# EAGLE design PowerBoard (EAGLE 7.3.0)
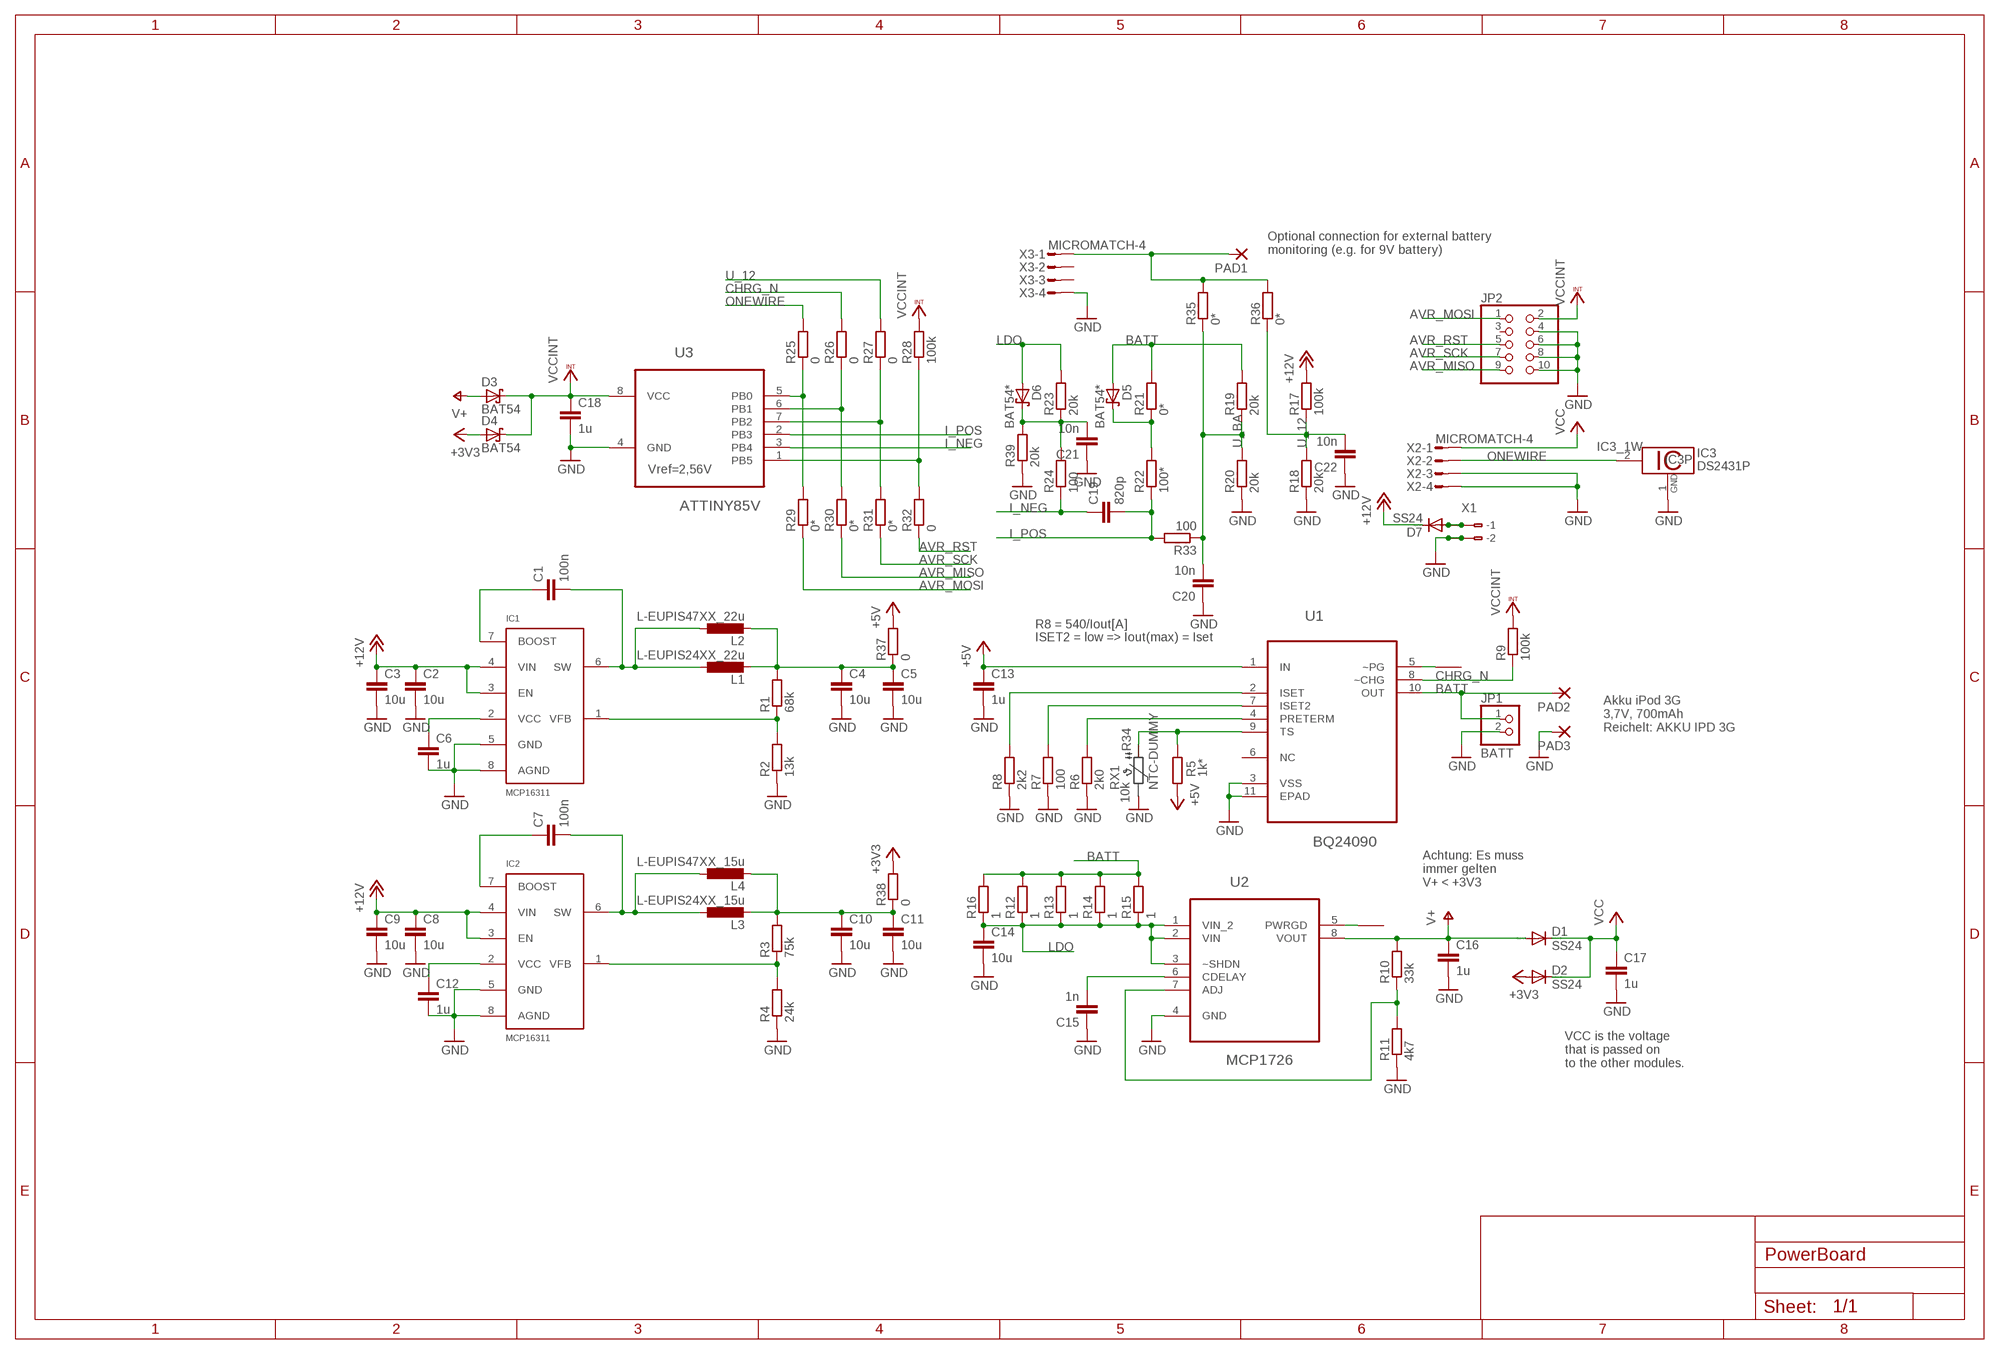
[diagram p0: schematic, sheet 1]

## Parts
C1  100n  C-EUC0603  [C0603]
C2  10u  C-EUC1210  [C1210]
C3  10u  C-EUC1210  [C1210]
C4  10u  C-EUC1210  [C1210]
C5  10u  C-EUC1210  [C1210]
C6  1u  C-EUC0603  [C0603]
C7  100n  C-EUC0603  [C0603]
C8  10u  C-EUC1210  [C1210]
C9  10u  C-EUC1210  [C1210]
C10  10u  C-EUC1210  [C1210]
C11  10u  C-EUC1210  [C1210]
C12  1u  C-EUC0603  [C0603]
C13  1u  C-EUC0603  [C0603]
C14  10u  C-EUC1210  [C1210]
C15  1n  C-EUC0603  [C0603]
C16  1u  C-EUC0603  [C0603]
C17  1u  C-EUC0603  [C0603]
C18  1u  C-EUC0603  [C0603]
C19  820p  C-EUC0603  [C0603]
C20  10n  C-EUC0603  [C0603]
C21  10n  C-EUC0603  [C0603]
C22  10n  C-EUC0603  [C0603]
D1  SS24  DIODE-SMB  [SMB]
D2  SS24  DIODE-SMB  [SMB]
D3  BAT54  [SOT23]
D4  BAT54  [SOT23]
D5  BAT54*  BAT54  [SOT23]
D6  BAT54*  BAT54  [SOT23]
D7  SS24  DIODE-SMB  [SMB]
IC1  MCP16311  [SOP65P490X110-8N]
IC2  MCP16311  [SOP65P490X110-8N]
IC3  DS2431P  [TSOC6]
JP1  BATT  PINHD-1X2  [1X02]
JP2  PINHD-2X5  [2X05]
L1  L-EUPIS24XX_22u  L-EUPIS24XX  [PIS24XX]
L2  L-EUPIS47XX_22u  L-EUPIS47XX  [PIS47XX]
L3  L-EUPIS24XX_15u  L-EUPIS24XX  [PIS24XX]
L4  L-EUPIS47XX_15u  L-EUPIS47XX  [PIS47XX]
PAD1  WIREPADSMD2,54-5,08  [SMD2,54-5,08]
PAD2  WIREPADSMD2,54-5,08  [SMD2,54-5,08]
PAD3  WIREPADSMD2,54-5,08  [SMD2,54-5,08]
R1  68k  R-EU_R0603  [R0603]
R2  13k  R-EU_R0603  [R0603]
R3  75k  R-EU_R0603  [R0603]
R4  24k  R-EU_R0603  [R0603]
R5  1k*  R-EU_R0603  [R0603]
R6  2k0  R-EU_R0603  [R0603]
R7  100  R-EU_R0603  [R0603]
R8  2k2  R-EU_R0603  [R0603]
R9  100k  R-EU_R0603  [R0603]
R10  33k  R-EU_R0603  [R0603]
R11  4k7  R-EU_R0603  [R0603]
R12  1  R-EU_R0402  [R0402]
R13  1  R-EU_R0402  [R0402]
R14  1  R-EU_R0402  [R0402]
R15  1  R-EU_R0402  [R0402]
R16  1  R-EU_R0402  [R0402]
R17  100k  R-EU_R0603  [R0603]
R18  20k  R-EU_R0603  [R0603]
R19  20k  R-EU_R0603  [R0603]
R20  20k  R-EU_R0603  [R0603]
R21  0*  R-EU_R0603  [R0603]
R22  100*  R-EU_R0603  [R0603]
R23  20k  R-EU_R0603  [R0603]
R24  100  R-EU_R0603  [R0603]
R25  0  R-EU_R0402  [R0402]
R26  0  R-EU_R0402  [R0402]
R27  0  R-EU_R0402  [R0402]
R28  100k  R-EU_R0402  [R0402]
R29  0*  R-EU_R0402  [R0402]
R30  0*  R-EU_R0402  [R0402]
R31  0*  R-EU_R0402  [R0402]
R32  0  R-EU_R0402  [R0402]
R33  100  R-EU_R0603  [R0603]
R34  10k  R-EU_R0603  [R0603]
R35  0*  R-EU_R0603  [R0603]
R36  0*  R-EU_R0603  [R0603]
R37  0  R-EU_R0603  [R0603]
R38  0  R-EU_R0603  [R0603]
R39  20k  R-EU_R0603  [R0603]
U1  BQ24090  BQ24090DGQT  [SOP50P490X110-11N]
U2  MCP1726  MCP1726-3302E/SN  [SOIC127P490X175-8N]
U3  ATTINY85V  ATTINY85V-10SU  [SOIC127P798X216-8N]
U$1  PAD100-RND  [PAD-100-RND]
U$3  PAD100-RND  [PAD-100-RND]
X1  233-102  [233-102]
X2  MICROMATCH-4  [MICROMATCH-4]
X3  MICROMATCH-4  [MICROMATCH-4]

## Nets
+3V3: D2.A D4.1(A) R38.2
+5V: C13.1 R5.1 R37.2 U1.1(IN)
+12V: C2.1 C3.1 C8.1 C9.1 D7.C IC1.3(EN) IC1.4(VIN) IC2.3(EN) IC2.4(VIN) R17.2
AVR_MISO: JP2.9 R30.1
AVR_MOSI: JP2.1 R29.1
AVR_RST: JP2.5 R32.1
AVR_SCK: JP2.7 R31.1
BATT: D5.1(A) JP1.1 PAD2.1(P) R12.2 R13.2 R14.2 R15.2 R16.2 R19.2 R21.2 U1.10(OUT)
CHRG_N: R9.1 R26.2 U1.8(~CHG)
GND: C2.2 C3.2 C4.2 C5.2 C6.2 C8.2 C9.2 C10.2 C11.2 C12.2 C13.2 C14.2 C15.1 C16.2 C17.2 C18.2 C20.1 C21.1 C22.1 IC1.5(GND) IC1.8(AGND) IC2.5(GND) IC2.8(AGND) IC3.1(GND) JP1.2 JP2.4 JP2.6 JP2.8 JP2.10 PAD3.1(P) R2.1 R4.1 R6.1 R7.1 R8.1 R11.1 R18.1 R20.1 R34.1 R39.1 U1.3(VSS) U1.11(EPAD) U2.4(GND) U3.4(GND) X1.A2(-2) X1.B2(B-2) X2.3 X2.4 X3.4
I_NEG: C19.1 R24.1 U3.3(PB4)
I_POS: C19.2 R22.1 R33.2 U3.2(PB3)
LDO: C14.1 D6.1(A) R12.1 R13.1 R14.1 R15.1 R16.1 R23.2 U2.1(VIN_2) U2.2(VIN) U2.3(~SHDN)
N$1: C1.1 IC1.7(BOOST)
N$2: C1.2 IC1.6(SW) L1.2 L2.2
N$3: U2.5(PWRGD) U$3.P$1
N$4: R8.2 U1.2(ISET)
N$5: IC1.1(VFB) R1.1 R2.2
N$6: R7.2 U1.7(ISET2)
N$7: C6.1 IC1.2(VCC)
N$8: R6.2 U1.4(PRETERM)
N$9: C7.1 IC2.7(BOOST)
N$10: C7.2 IC2.6(SW) L3.2 L4.2
N$11: IC2.1(VFB) R3.1 R4.2
N$12: C12.1 IC2.2(VCC)
N$13: R5.2 R34.2 U1.9(TS)
N$14: U1.5(~PG) U$1.P$1
N$15: C15.2 U2.6(CDELAY)
N$16: R28.1 R32.2 U3.1(PB5)
N$17: D5.3(C) R21.1 R22.2
N$18: R27.1 R31.2 U3.7(PB2)
N$19: R26.1 R30.2 U3.6(PB1)
N$20: R10.1 R11.2 U2.7(ADJ)
N$21: C21.2 D6.3(C) R23.1 R24.2 R39.2
N$22: D7.A X1.A1(-1) X1.B1(B-1)
N$23: R25.1 R29.2 U3.5(PB0)
N$24: PAD1.1(P) R35.2 R36.2 X3.1
N$25: C4.1 C5.1 L1.1 L2.1 R1.2 R37.1
N$26: C10.1 C11.1 L3.1 L4.1 R3.2 R38.1
ONEWIRE: IC3.2(1W) R25.2 X2.2
U_12: C22.2 R17.1 R18.2 R27.2 R36.1
U_BA: C20.2 R19.1 R20.2 R33.1 R35.1
V+: C16.1 D1.A D3.1(A) R10.2 U2.8(VOUT)
VCC: C17.1 D1.C D2.C X2.1
VCCINT: C18.1 D3.3(C) D4.3(C) JP2.2 R9.2 R28.2 U3.8(VCC)
Unconnected: JP2.3 U1.6(NC) X3.2 X3.3

## Notes on the sheet
- Optional connection for external battery
  monitoring (e.g. for 9V battery)
- Vref=2,56V
- R8 = 540/Iout[A]
- ISET2 = low => Iout(max) = Iset
- Akku iPod 3G
  3,7V, 700mAh
  Reichelt: AKKU IPD 3G
- Achtung: Es muss
  immer gelten
  V+ < +3V3
- VCC is the voltage
  that is passed on
  to the other modules.

## Library data of the parts
C1-C22 = rcl:C-EU: CAPACITOR, European symbol
D1 D2 D7 = diode:DIODE-: DIODE
D3-D6 = diode:BAT54: Schottky Diodes Source: Fairchild .. BAT54.pdf
IC1 IC2 = mcp16311_SOP65P490X110-8N:MCP16311
IC3 = 1wire:DS2431: 1024-Bit EEPROM This chip provides a 4x256 Bit EEPROM, which can be programmed@5V. Write protection and OTP emulation are available, too. Author: Jan Kandziora <jjj@gmx.de>
JP1 = pinhead:PINHD-1X2: PIN HEADER
JP2 = pinhead:PINHD-2X5: PIN HEADER
L1-L4 = Inductor-Fastron:L-EU
PAD1-PAD3 = wirepad:WIREPAD: Wire PAD connect wire on PCB
R1-R39 = rcl:R-EU_: RESISTOR, European symbol
U1 = BQ24090DGQT:BQ24090DGQT: 1A, Single-Input, Single Cell Li-Ion Battery Charger; AVAILABILITY: Good; DESCRIPTION: 1A%2C Single Input%2C Single Cell Li-Ion Battery Charger w/ 10k%3F NTC %7C Li-ion Linear Battery Charger IC 10-MSOP-PowerPAD ...; MF: Texas Instruments; MP: BQ24090DGQT; PACKAGE: MSOP-10 Texas Instruments; PRICE: 0.96 USD
U2 = MCP1726-3302E_SN:MCP1726-3302E/SN: Current LDO Regulator; AVAILABILITY: Good; DESCRIPTION: MCP1726 Series 1 A 3.3 V Fixed Output Surface Mount LDO Regulator - SOIC-8; MF: Microchip; MP: MCP1726-3302E/SN; PACKAGE: SOIC-8 Microchip; PRICE: 0.63 USD
U3 = ATTINY85V-10SU:ATTINY85V-10SU: 8-bit Microcontroller with In-System Programmable Flash; AVAILABILITY: Good; DESCRIPTION: ATtiny Series 10 MHz 8 KB Flash 512 B SRAM 8-Bit Microcontroller - SOIC-8; MF: Atmel; MP: ATTINY85V-10SU; PACKAGE: SOIC-8 Atmel; PRICE: 1.19 USD
U$1 U$3 = Pinoccio:PAD
X1 = con-wago:233-102: WAGO Cage Clamp; MPN: 233-102; OC_FARNELL: unknown; OC_NEWARK: 28K9044
X2 X3 = con-amp-micromatch:MICROMATCH-4: MicroMaTch 4 7-215464-4 / 0-215464-4 Drawing Number C-215464 DDEController.pdf; MPN: 7-215464-4; OC_FARNELL: 3784629; OC_NEWARK: 19R8124

## Board
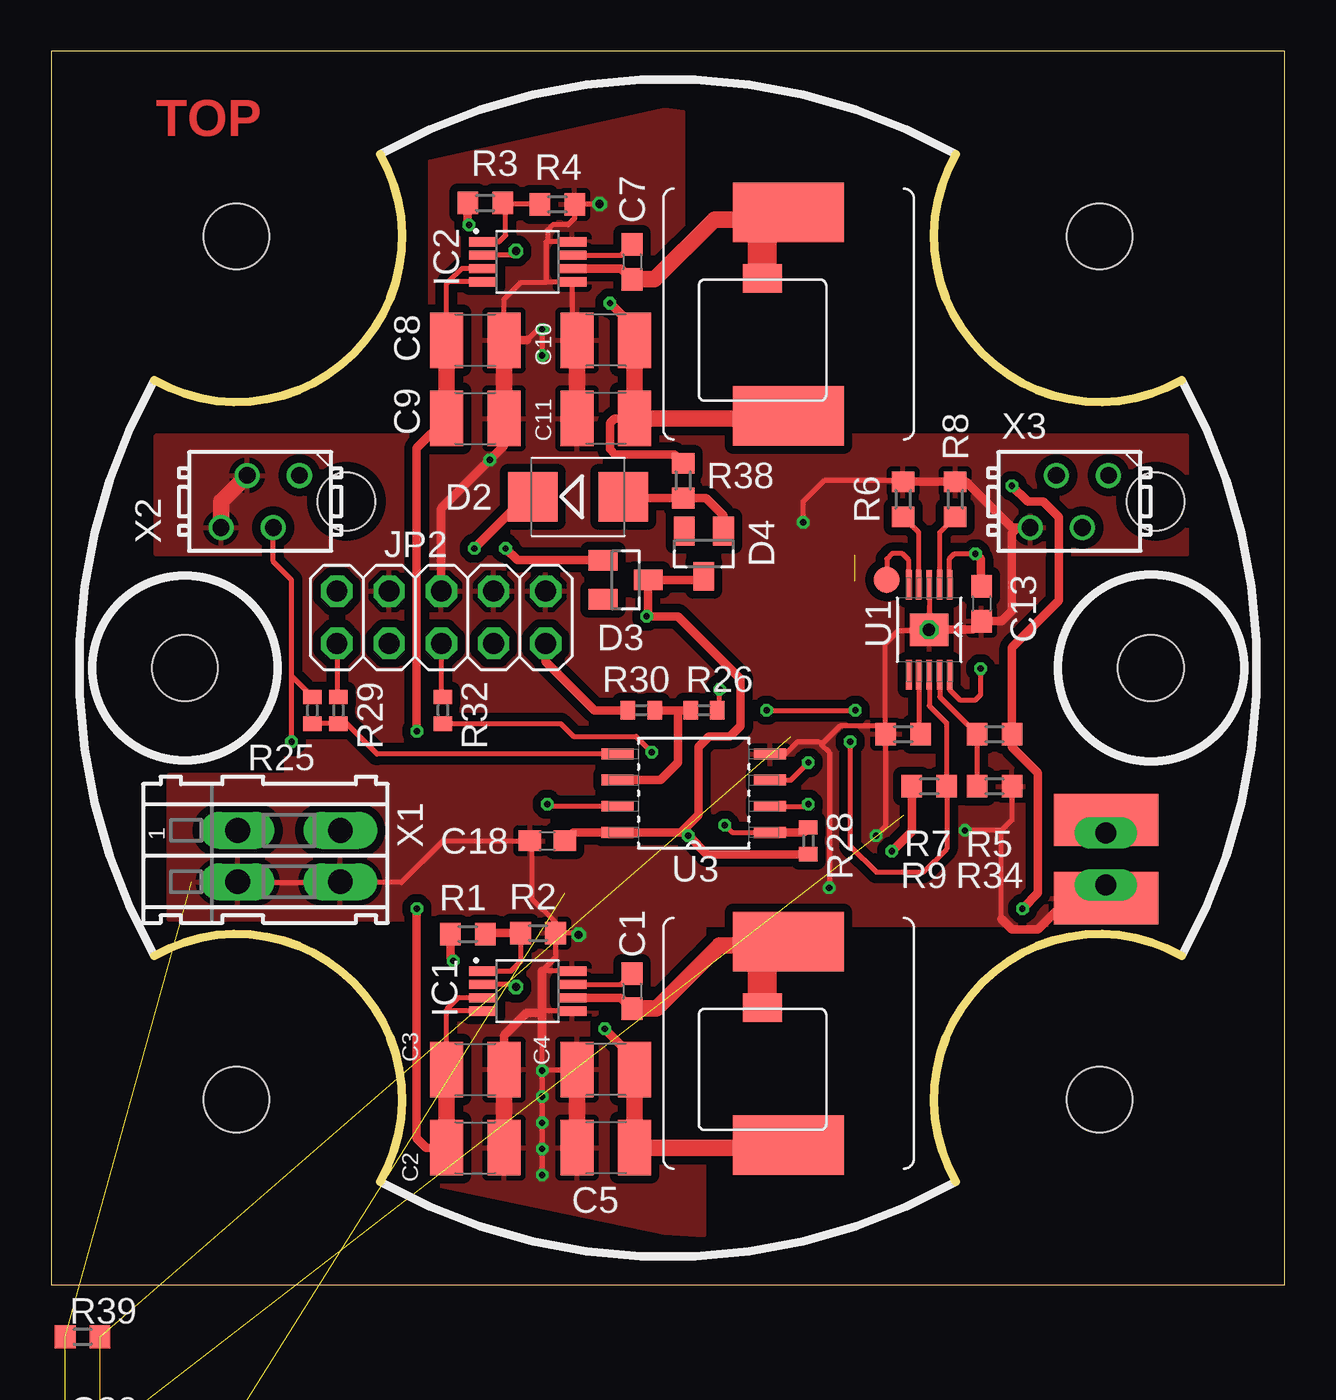
[diagram p1: board, top side]
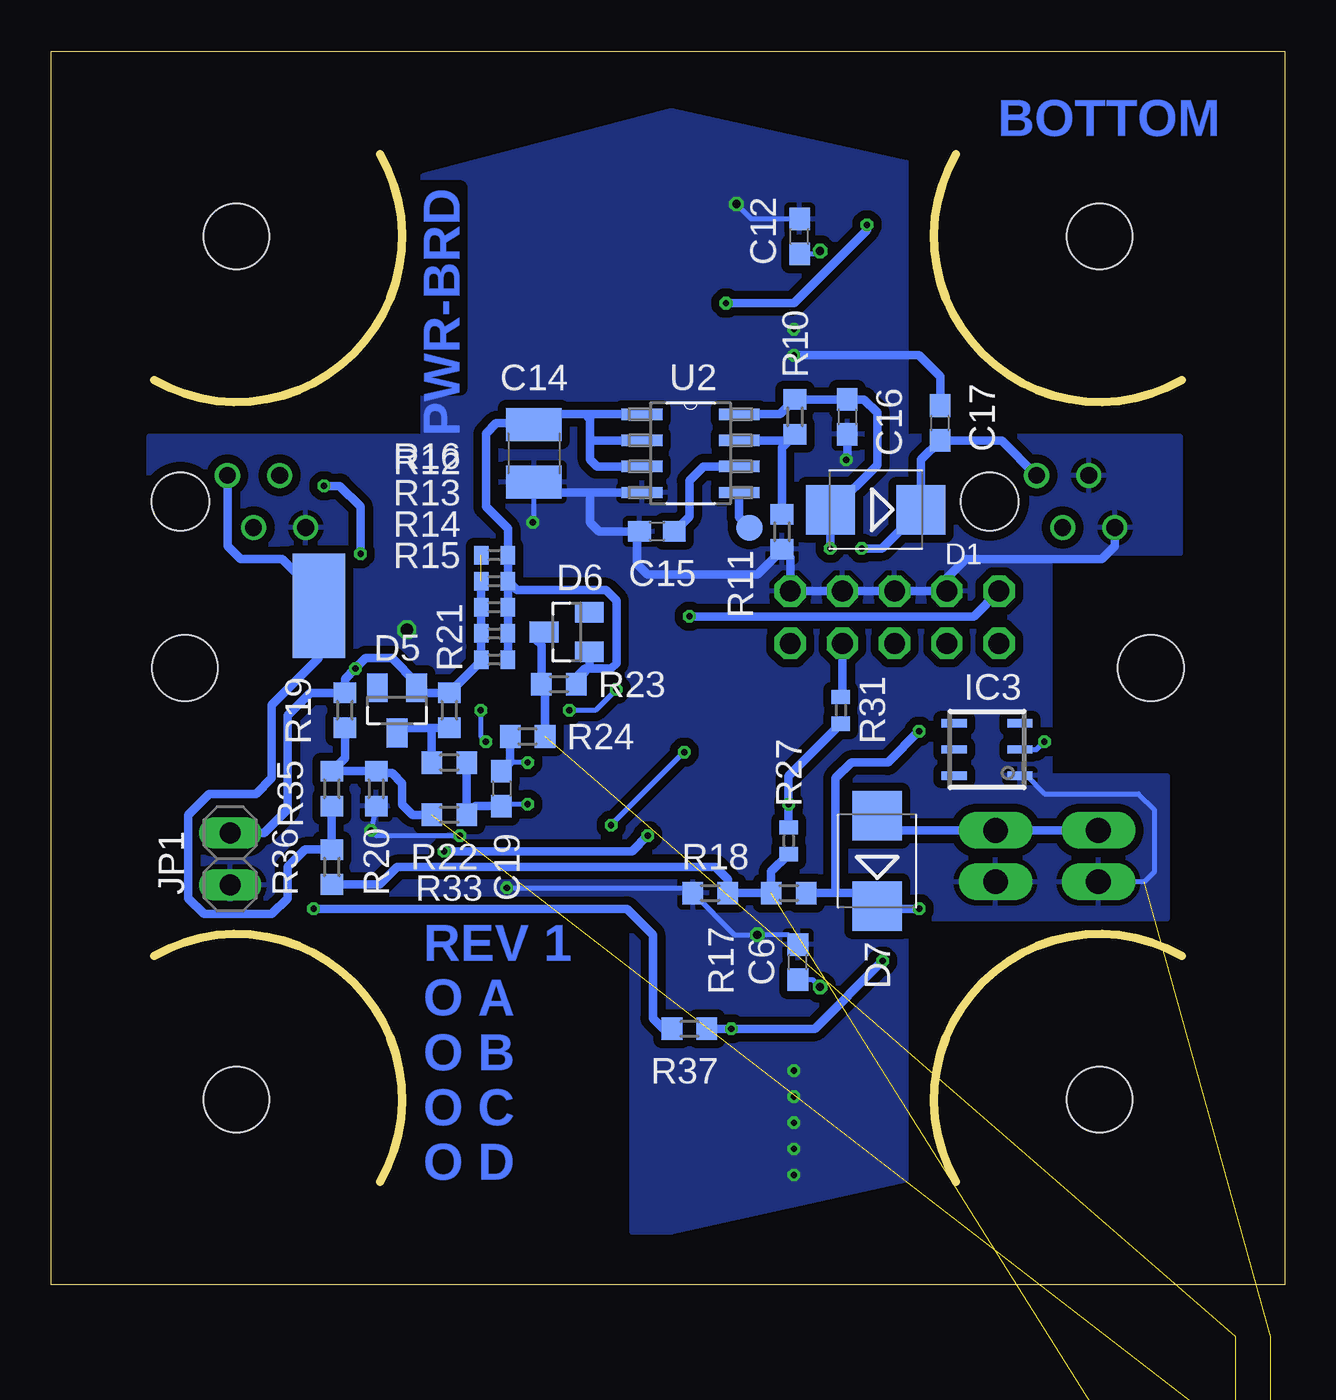
[diagram p2: board, bottom side, seen from below]

Size 60 x 60 mm. Coordinates in mm from the lower left corner, seen from the top.
Outline: 0,0 60,0 60,60 0,60 0,0
Copper layers (1*16): Top 0.035mm / dielectric 1.6mm / Bottom 0.035mm
Design rules "Elecrow_2-layer_PCB_eagle_rule": minimum track width 6mil, minimum drill 12mil, track to track 6mil, track to pad 6mil, pad to pad 6mil, via to via 8mil, smd to smd 0mil, copper to edge 20mil, drill to drill 10mil, minimum pad ring 6mil, minimum via ring 6mil, stop-mask expansion 0mil, vias tented up to drill 100mil, thermal gap 10mil
Holes 3.2 mm at 9,51 51,51 51,9 9,9 6.5,30 53.5,30
Holes 2.8 mm at 14.35,38.1 53.72,38.1
Milling: 4 lines

### Footprints (pad centres in the part's own frame; a part is rotated, then mirrored left to right if it is on the bottom)
C0603 = smd 1.1 x 1: 1 -0.85,0; 2 0.85,0
C1210 = smd 1.6 x 2.7: 1 -1.4,0; 2 1.4,0
SMB = smd 2.4 x 2.4: A 2.2,0; C -2.2,0
SOT23 = smd 1 x 1.4: 1 -0.95,-1.1; 2 0.95,-1.1; 3 0,1.1
SOP65P490X110-8N = smd 1.38 x 0.45: 1 -2.165,0.975; 2 -2.165,0.325; 3 -2.165,-0.325; 4 -2.165,-0.975; 5 2.165,-0.975; 6 2.165,-0.325; 7 2.165,0.325; 8 2.165,0.975
TSOC6 = smd 0.406 x 1.219: 1 -1.27,-1.6; 2 0,-1.6; 3 1.27,-1.6; 4 1.27,1.6; 5 0,1.6; 6 -1.27,1.6
1X02 = drill 1.016 long: 1 -1.27,0; 2 1.27,0
2X05 = drill 1.016 octagon: 1 -5.08,-1.27; 2 -5.08,1.27; 3 -2.54,-1.27; 4 -2.54,1.27; 5 0,-1.27; 6 0,1.27; 7 2.54,-1.27; 8 2.54,1.27; 9 5.08,-1.27; 10 5.08,1.27
PIS24XX = smd 1.4 x 1.9: 1 -3,0; 2 3,0
PIS47XX = smd 2.9 x 5.4: 1 -4.95,0; 2 4.95,0
SMD2,54-5,08 = smd 2.54 x 5.08: 1 0,0
R0603 = smd 1 x 1.1: 1 -0.85,0; 2 0.85,0
R0402 = smd 0.7 x 0.9: 1 -0.65,0; 2 0.65,0
SOP50P490X110-11N = smd 1.422 x 0.279: 1 -2.184,0.991; 2 -2.184,0.508; 3 -2.184,0; 4 -2.184,-0.508; 5 -2.184,-0.991; 6 2.184,-0.991; 7 2.184,-0.508; 8 2.184,0; 9 2.184,0.508; 10 2.184,0.991 | smd 1.575 x 1.88: 11 0,0
SOIC127P490X175-8N = smd 1.981 x 0.559: 1 -2.362,1.905; 2 -2.362,0.635; 3 -2.362,-0.635; 4 -2.362,-1.905; 5 2.362,-1.905; 6 2.362,-0.635; 7 2.362,0.635; 8 2.362,1.905
SOIC127P798X216-8N = smd 1.549 x 0.533: 1 -3.708,1.905; 2 -3.708,0.635; 3 -3.708,-0.635; 4 -3.708,-1.905; 5 3.708,-1.905; 6 3.708,-0.635; 7 3.708,0.635; 8 3.708,1.905
PAD-100-RND = smd 1.27 x 1.27: P$1 0,0
233-102 = drill 1.2 long: A1 -1.25,2.5; A2 1.25,2.5; B1 -1.25,-2.5; B2 1.25,-2.5
MICROMATCH-4 = drill 0.813: 1 1.905,1.27; 2 0.635,-1.27; 3 -0.635,1.27; 4 -1.905,-1.27

### Placement (x,y rotation side)
C1  28.25,14.28 270 top
C2  20.63,6.66 0 top
C3  20.63,10.47 0 top
C4  26.98,10.47 180 top
C5  26.98,6.66 180 top
C6  23.68,15.69 90 bottom
C7  28.25,49.76 270 top
C8  20.63,45.95 0 top
C9  20.63,42.14 0 top
C10  26.98,45.95 180 top
C11  26.98,42.14 180 top
C12  23.6,51 90 bottom
C13  45.25,33.13 270 top
C14  36.52,40.44 270 bottom
C15  30.54,36.65 0 bottom
C16  21.28,42.22 270 bottom
C17  16.76,41.92 90 bottom
C18  24.13,21.59 180 top
C19  38.1,24.13 270 bottom
C20  1.52,-7.37 0 top  (outside the outline)
C21  1.52,-12.19 0 top  (outside the outline)
C22  1.52,-17.02 0 top  (outside the outline)
D1  19.89,37.7 180 bottom
D2  25.63,38.33 0 top
D3  27.94,34.29 270 top
D4  31.75,35.56 180 top
D5  43.18,27.94 180 bottom
D6  34.92,31.75 90 bottom
D7  19.82,20.61 90 bottom
IC1  23.17,14.28 0 top
IC2  23.17,49.76 0 top
IC3  14.48,26.04 90 bottom
JP1  51.3,20.71 270 bottom
JP2  18.97,32.47 0 top
L1  34.6,10.47 90 top
L2  35.87,11.74 90 top
L3  34.6,45.95 90 top
L4  35.87,47.22 90 top
PAD1  46.99,33.02 180 bottom
PAD2  51.31,22.61 90 top
PAD3  51.31,18.8 90 top
R1  20.26,17.06 180 top
R2  23.68,17.11 180 top
R3  21.11,52.62 180 top
R4  24.61,52.55 180 top
R5  45.88,26.78 180 top
R6  41.44,38.21 270 top
R7  41.44,26.78 0 top
R8  43.98,38.21 270 top
R9  42.71,24.24 180 top
R10  23.82,42.22 90 bottom
R11  24.45,36.63 90 bottom
R12  38.44,34.22 180 bottom
R13  38.44,32.95 180 bottom
R14  38.44,31.68 180 bottom
R15  38.44,30.41 180 bottom
R16  38.44,35.49 180 bottom
R17  24.13,19.05 0 bottom
R18  27.94,19.05 0 bottom
R19  45.72,27.94 90 bottom
R20  44.2,24.13 90 bottom
R21  40.64,27.94 90 bottom
R22  40.64,25.4 180 bottom
R23  35.31,29.21 0 bottom
R24  36.83,26.67 0 bottom
R25  12.7,27.94 90 top
R26  31.75,27.94 0 top
R27  24.13,21.59 270 bottom
R28  36.83,21.59 270 top
R29  13.97,27.94 270 top
R30  28.7,27.94 0 top
R31  21.59,27.94 270 bottom
R32  19.05,27.94 270 top
R33  40.64,22.86 0 bottom
R34  45.88,24.24 180 top
R35  46.35,24.13 270 bottom
R36  46.35,20.32 90 bottom
R37  28.96,12.45 180 bottom
R38  30.73,39.12 270 top
R39  1.52,-2.54 0 top
U1  42.71,31.86 270 top
U2  28.9,40.44 0 bottom
U3  31.25,23.91 180 top
U$1  40.64,34.29 0 top
U$3  26.04,36.83 0 bottom
X1  11.56,20.85 270 top
X2  10.16,38.1 0 top
X3  49.53,38.1 0 top

### Tracks (layer width: path | path; a pad name or v marks a point on that pad's centre or on a via)
+3V3
  Top 0.406: 28.38,38.88 28.28,38.78 | 28.28,38.78 D2.A | D4.1 32.7,37.4 31.84,38.27 R38.2 28.79,38.27 28.28,38.78
+5V  (via drill 0.3)
  Top 0.254: U1.1 43.7,35.32 43.94,35.56 v44.96,35.56
  Top 0.406: v44.96,35.56 45.21,35.31 45.21,34.02 C13.1 | v46.74,38.86 47.5,38.1 48.26,38.1 49.02,37.34 49.02,33.27 46.73,30.99 R5.1 46.73,26.16 48.01,24.89 48.01,19.05 v47.24,18.29
  Bottom 0.406: v46.74,38.86 45.97,38.86 44.96,37.85 v44.96,35.56 | v47.24,18.29 32,18.29 30.73,17.02 30.73,12.95 30.23,12.45 R37.2
+12V  (via drill 0.3)
  Top 0.254: IC2.3 19.97,49.44 19.32,48.78 | 19.32,48.78 19.23,48.69 C8.1 | IC2.4 19.32,48.78 | IC1.3 19.8,13.96 19.23,13.39 19.23,13.21 | C3.1 19.23,13.21 | IC1.4 19.33,13.3 19.23,13.21
  Top 0.406: v17.78,18.29 17.78,7.11 18.23,6.66 C2.1 | C9.1 17.78,40.69 v17.78,26.92
  Top 0.813: C8.1 C9.1 | C2.1 C3.1
  Bottom 0.406: R17.2 21.84,19.05 | 21.84,19.05 20.46,19.05 D7.C 19.7,18.29 v17.78,18.29 | 21.84,19.05 21.84,24.64 21.08,25.4 19.3,25.4 v17.78,26.92
AVR_MISO
  Top 0.406: JP2.9 24.05,30.3 26.42,27.94 R30.1
AVR_MOSI
  Top 0.254: JP2.1 13.89,28.67 R29.1
AVR_RST
  Top 0.254: JP2.5 18.97,28.67 R32.1
AVR_SCK
  Bottom 0.406: JP2.7 21.51,28.67 R31.1
BATT  (via drill 0.3)  (1 unrouted)
  Top 0.254: U1.10 43.7,28.94 44.2,28.45 44.96,28.45 45.21,28.7 v45.21,29.97
  Top 0.406: PAD2.1 JP1.1
  Bottom 0.406: R12.2 R13.2 R14.2 R15.2 39.09,30.34 R21.2 41.98,28.79 D5.1 42.23,29.28 43.43,30.48 44.7,30.48 v45.21,29.97 45.72,29.46 R19.2 47.41,28.79 48.51,27.69 48.51,23.11 49.65,21.98 JP1.1
CHRG_N  (via drill 0.3)
  Top 0.254: U1.8 42.71,28.16 43.56,27.31 R9.1 43.56,21.21 42.42,20.07 40.13,20.07 38.86,21.34 v38.86,26.42 | R26.2 32.51,28.05 v32.51,28.96 | v34.8,27.94 v39.12,27.94
  Bottom 0.254: v32.51,28.96 33.53,27.94 v34.8,27.94 | v39.12,27.94 39.12,26.67 v38.86,26.42
GND  (via drill 0.3, 0.4, 0.6)  (4 unrouted)
  Top 0.254: C10.2 25.34,46.2 IC2.5 24.07,48.78 | IC2.8 24.07,50.73 | 24.07,50.73 24.07,48.78 | 24.07,50.73 24.13,50.8 24.13,51.31 24.38,51.56 25.15,51.56 25.46,51.88 R4.1 25.49,52.58 v26.67,52.58 | C8.2 22.03,47.94 22.86,48.77 24.05,48.77 24.07,48.78 | U1.3 U1.11 42.71,31.79 | 42.71,31.79 v42.7,31.85 | IC1.8 23.88,15.26 24.53,15.91 R2.1 | IC1.5 23.88,13.3 | v25.65,17.02 25.57,17.11 R2.1 | X1.B2 9.1,19.56 14.1,19.56 | R2.1 24.53,17.64 23.37,18.8 23.37,21.5 C18.2 19.05,21.59 17.02,19.56 14.1,19.56 | U3.4 35.72,25.82 36.32,26.42 37.34,26.42 37.47,26.29 | 37.47,26.29 37.85,25.91 v37.85,19.3 | 44.7,22.1 v44.45,22.1 46.23,22.1 | JP1.2 50.91,19.05 49.78,19.05 | PAD3.1 51.31,18.29 | R34.1 46.73,22.61 46.23,22.1 | 42.71,31.79 41.19,31.79 40.59,31.19 R7.1 | R7.1 40.59,22.3 v40.13,21.84 | R6.1 41.38,39.12 37.59,39.12 36.58,38.1 v36.58,37.08 | R7.1 40.19,27.18 38.35,27.18 37.47,26.29 | 46.23,17.78 46.23,22.1 | 14.1,19.56 X1.A2 | 25.34,10.47 25.29,10.41 v23.88,10.41 v23.88,9.14 v23.88,7.87 v23.88,6.6 v23.88,5.33 23.88,11.94 | 23.14,45.95 23.67,46.48 v23.88,46.48 v23.88,45.21
  Top 0.406: R6.1 R8.1 44.51,39.06 46.74,36.83 46.99,36.83 | X3.4 46.99,36.83 | 46.99,36.83 46.74,36.58 46.74,32.77 46.25,32.28 C13.2 44.83,31.86 U1.11 | 23.88,15.26 23.88,13.3 23.88,13.21 | C4.2 25.34,10.47 | 23.88,11.94 23.88,13.21 | C3.2 22.03,12.12 23.11,13.21 23.88,13.21 | C9.2 22.03,40.83 v21.34,40.13 18.97,37.77 JP2.6 | 23.14,45.95 C8.2 | 49.78,19.05 48.01,17.27 46.74,17.27 46.23,17.78 | PAD3.1 JP1.2
  Top 0.813: C11.2 C10.2 | C9.2 C8.2 | X2.4 8.26,38.1 X2.3 | C4.2 C5.2 | C3.2 C2.2
  Bottom 0.254: C12.2 25.94,51.85 v26.67,52.58 | C6.2 24.15,17.02 v25.65,17.02 26.76,17.02 R18.1 29.04,19.3 v37.85,19.3 | R20.1 v44.45,22.1 44.2,21.84 v40.13,21.84 | v36.58,37.08 36.52,37.14 C14.2 | IC3.1 12.57,24.77 11.68,23.88 7.11,23.88 6.35,23.11 6.35,20.07 6.82,19.6 X1.B2
  Bottom 0.406: U2.4 33.78,38.53 | 33.78,38.53 36.02,38.53 C14.2 | 33.78,38.53 33.78,37.08 33.35,36.65 C15.1 31.5,36.54 31.5,35.05 30.99,34.54 25.65,34.54 24.45,35.74 R11.1 24.05,35.38 JP2.10 JP2.8 JP2.6 JP2.4 16.43,34.37 15.49,35.31 8.89,35.31 8.26,35.94 X2.4 | C16.2 21.28,40.19 v21.34,40.13 | C17.2 16.76,44.19 17.78,45.21 v23.88,45.21
  pour Top (isolate 0.406): 5.08,35.56 11.43,35.56 11.43,24.77 5.71,24.77 5.71,17.78 17.78,17.78 17.78,5.08 29.84,2.54 31.75,2.41 31.75,17.53 48.77,17.53 48.51,24.77 48.26,24.77 48.26,35.56 55.24,35.56 55.24,41.27 30.73,41.27 30.73,57.02 29.84,57.15 18.41,54.61 18.41,41.27 5.08,41.27
  pour Bottom (isolate 0.406): 5.08,41.27 5.08,35.56 11.43,35.56 11.43,24.77 5.71,24.77 5.71,17.78 18.41,17.78 18.41,5.08 29.84,2.54 31.75,2.54 31.75,17.78 54.61,17.78 54.61,24.77 48.26,24.77 48.26,35.56 55.24,35.56 55.24,41.27 41.91,41.27 41.91,53.98 29.84,57.15 18.41,54.61 18.41,41.27
I_NEG  (via drill 0.3)
  Top 0.254: U3.3 35.98,24.55 v36.83,25.4
  Bottom 0.254: v36.83,25.4 37.68,25.4
  Bottom 0.406: R24.1 37.68,25.4 C19.1
I_POS  (via drill 0.3)
  Top 0.254: U3.2 36.74,23.27 v36.83,23.37
  Bottom 0.254: v36.83,23.37 38.01,23.37 C19.2
  Bottom 0.406: R22.1 R33.2 39.37,23.28 C19.2
LDO
  Bottom 0.406: 34.04,42.34 36.02,42.34 C14.1 36.59,41.91 38.35,41.91 38.86,41.4 38.86,37.85 37.79,36.77 R16.1 R15.1 R14.1 R13.1 R12.1 | 34.04,42.34 U2.1 | U2.3 33.45,39.8 33.78,40.13 33.78,41.15 | 33.78,41.15 33.78,42.09 34.04,42.34 | U2.2 33.71,41.08 33.78,41.15 | R12.1 37.79,35.25 | D6.1 33.83,30.09 R23.2 34.71,29.3 34.04,29.97 32.77,29.97 32.51,30.23 32.51,33.27 33.02,33.78 37.35,33.78 R12.1
N$1
  Top 0.254: IC1.7 27.73,14.61 C1.1
N$2
  Top 0.406: IC1.6 27.73,13.96 C1.2
  Top 0.813: C1.2 29.43,13.43 32.51,16.51 35.31,16.51 | 35.31,16.51 35.69,16.51 L2.2 | 34.6,15.8 35.31,16.51
  Top 1.422: L1.2 34.6,15.8
N$3
  Bottom 0.406: U2.5 26.54,37.33 U$3.P$1
N$4
  Top 0.254: U1.2 43.22,36.6 R8.2
N$5
  Top 0.254: IC1.1 22.37,15.26 22.83,15.72 R2.2
  Top 0.406: R2.2 21.16,17.11 R1.1
N$6
  Top 0.254: U1.7 42.2,26.87 R7.2
N$7  (via drill 0.4)
  Top 0.254: v22.61,14.48 22.48,14.61 IC1.2
  Bottom 0.254: C6.1 22.97,14.84 v22.61,14.48
N$8
  Top 0.254: U1.4 42.2,36.6 R6.2
N$9
  Top 0.254: IC2.7 27.73,50.09 C7.1
N$10
  Top 0.406: IC2.6 27.73,49.44 C7.2
  Top 0.813: C7.2 29.35,48.91 32.26,51.82 35.05,51.82 | 35.05,51.82 35.52,51.82 L4.2 | 34.6,51.36 35.05,51.82
  Top 1.422: L3.2 34.6,51.36
N$11
  Top 0.254: R4.2 22.02,52.55 R3.1 22.1,52.48 22.1,51.05 21.78,50.73 IC2.1
N$12  (via drill 0.4)
  Top 0.254: v22.61,50.29 22.4,50.09 IC2.2
  Bottom 0.254: C12.1 22.75,50.15 v22.61,50.29
N$13
  Top 0.254: U1.9 43.22,28.6 R5.2 R34.2
N$14
  Top 0.254: U1.5 41.72,35.24 41.4,35.56 40.89,35.56 40.64,35.31 U$1.P$1
N$15
  Bottom 0.406: U2.6 28.27,39.8 28.96,39.12 28.96,37.38 C15.2
N$16  (via drill 0.3)
  Top 0.254: R32.2 24.78,27.29 25.4,26.67 28.45,26.67 v29.21,25.91 | v32.77,22.35 33.11,22 U3.1
  Top 0.406: U3.1 36.59,22 R28.1
  Bottom 0.254: v29.21,25.91 v32.77,22.35
N$17
  Bottom 0.406: R21.1 41.4,27.09 | 41.4,27.09 42.93,27.09 D5.3 | R22.2 41.49,27 41.4,27.09
N$18  (via drill 0.3)
  Top 0.254: U3.7 24.22,23.27 v24.13,23.37
  Bottom 0.406: R27.1 v24.13,23.37 24.13,24.75 R31.2
N$19
  Top 0.406: R30.2 30.48,27.94 | 30.48,27.94 R26.1 | U3.6 29.62,24.55 30.48,25.4 30.48,27.94
N$20
  Bottom 0.406: U2.7 24.11,41.08 R10.1 24.45,40.73 R11.2
N$21  (2 unrouted)
  Bottom 0.406: D6.3 36.41,31.36 36.16,31.11 R23.1 35.98,28.78 R24.2
N$22
  Bottom 0.406: D7.A 19.11,22.1 X1.A1 X1.B1
N$23
  Top 0.254: U3.5 15.84,25.82 14.37,27.29 R29.2 R25.1
N$24
  Bottom 0.406: X3.1 51.44,35.94 50.8,35.31 48.77,35.31 46.99,33.53 PAD1.1 46.99,30.48 49.28,28.19 49.28,24.64 50.04,23.88 52.32,23.88 53.34,22.86 53.34,18.8 52.58,18.03 49.28,18.03 48.51,18.8 48.51,20.32 47.66,21.17 R36.2 R35.2
N$25  (via drill 0.3)
  Top 0.406: v26.92,12.45 28.38,10.99 C4.1 | R1.2 19.41,15.89 v19.56,15.75
  Top 0.813: L2.1 35.28,6.79 L1.1 33.79,6.66 C5.1 C4.1
  Bottom 0.406: R37.1 v26.92,12.45 22.86,12.45 v19.56,15.75
N$26  (via drill 0.3)
  Top 0.406: C11.1 27.41,42.14 27.18,41.91 27.18,40.64 27.43,40.39 30.31,40.39 R38.1 | C10.1 28.38,46.55 v27.18,47.75 | R3.2 20.26,51.63 v20.32,51.56
  Top 0.813: L4.1 35.28,42.27 34.97,42.59 | 34.97,42.59 L3.1 | 34.97,42.59 34.52,42.14 C11.1 C10.1
  Bottom 0.406: v27.18,47.75 23.88,47.75 20.32,51.31 v20.32,51.56
ONEWIRE  (via drill 0.3)
  Top 0.254: R25.2 11.68,29.61 | 11.68,29.61 11.68,29.72 11.68,34.29 10.79,35.18 X2.2 | v11.68,26.42 11.68,29.61
  Bottom 0.254: IC3.2 12.06,26.04 v11.68,26.42
U_12  (1 unrouted)
  Bottom 0.406: R27.2 24.98,20.09 R17.1 R18.2 27.09,19.72 27.69,20.32 43.18,20.32 44.03,19.47 R36.1
U_BA  (1 unrouted)
  Bottom 0.406: R19.1 45.72,25.61 R35.1 R20.2 44.36,24.89 43.43,24.89 42.93,24.38 42.93,23.37 42.42,22.86 R33.1
V+  (via drill 0.3)
  Top 0.406: D3.1 22.67,35.24 v22.1,35.81
  Bottom 0.406: U2.8 24.54,42.34 R10.2 C16.1 20.46,43.07 19.81,42.42 19.81,39.88 21.99,37.7 D1.A v22.1,35.81
VCC  (via drill 0.3)
  Top 0.406: D2.C 23.09,38.33 v20.57,35.81
  Bottom 0.406: v20.57,35.81 19.58,35.81 D1.C 17.7,40.13 C17.1 13.76,41.07 X2.1
VCCINT  (via drill 0.3)
  Top 0.406: U3.8 25.39,22 C18.1 | U3.8 30.83,22 v30.99,21.84 31.89,20.94 R28.2 | U3.8 30.64,22 31.5,22.86 31.5,26.16 32,26.67 33.02,26.67 33.53,27.18 33.53,29.46 30.48,32.51 v28.96,32.51 29.04,32.6 D3.3 30.48,34.29 30.73,34.29 31.58,34.29 D4.3 | R9.2 41.86,22.05 v40.89,21.08
  Bottom 0.406: JP2.2 15.12,32.51 v28.96,32.51 | v40.89,21.08 31.75,21.08 v30.99,21.84

### Text on the board
Top: TOP
Bottom: BOTTOM | PWR-BRD | REV 1 / O A / O B / O C / O D
tValues: - +